# Altium schematic sheet Microcontrolador.SchDoc: Microprocesador SAMG55J
size A4; Author: **; CompanyName: Introducción al Diseño de Circuitos Impresos; Organization: UTN FRBA; Revision: 00; Autor: Eugenia Ipar
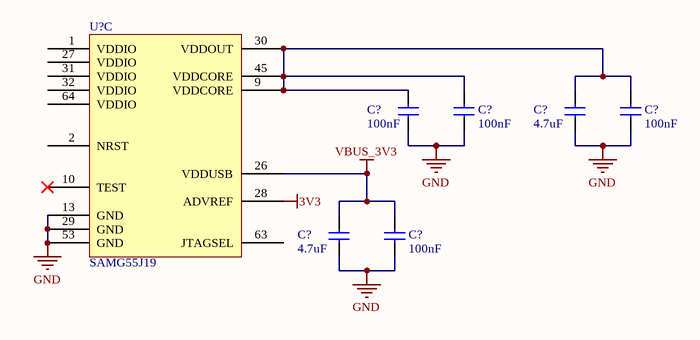
[diagram p0: Microcontrolador.SchDoc]

## Parts
(Parts that share a designator on the sheet are numbered #1, #2 ... from top to bottom, then left to right.)
C?#1  100nF
C?#2  100nF
C?#3  4.7uF
C?#4  100nF
C?#5  4.7uF
C?#6  100nF
U?  SAMG55J19  (part C of 3)

## Nets
3V3: U?.28(ADVREF)
GND: C?#1.2 C?#2.2 C?#3.2 C?#4.2 C?#5.2 C?#6.2 U?.13(GND) U?.29(GND) U?.53(GND)
VBUS_3V3: C?#5.1 C?#6.1 U?.26(VDDUSB)
NetC?#1_1: C?#1.1 C?#2.1 C?#3.1 C?#4.1 U?.9(VDDCORE) U?.30(VDDOUT) U?.45(VDDCORE)

Not connected (* = marked no-connect by the designer): U? 1(VDDIO) 2(NRST) 10(TEST)* 27(VDDIO) 31(VDDIO) 32(VDDIO) 63(JTAGSEL) 64(VDDIO)

## Notes on the sheet
- Title:
- Size:
- Author:
- A4
- Sheet
- of
- Revision:
- File:
- Date:

## Library data of the parts
C?#1-C?#6 = Ceramic Capacitor: Ceramic Capacitor SMD 0402
U? = SAMG55J19: Atmel SMART SAM G55 Cortex M4 32-bit 64-lead LQFP